# EasyEDA schematic I-Ching connection board v3_2020-09-12_02-23-30.json
TITLE: I-Ching connection board; REV: 1.3; Date: 2020-06-28; Sheet: 1/1; Drawn By: ferrie.bank; Company: Oude Snepelaar
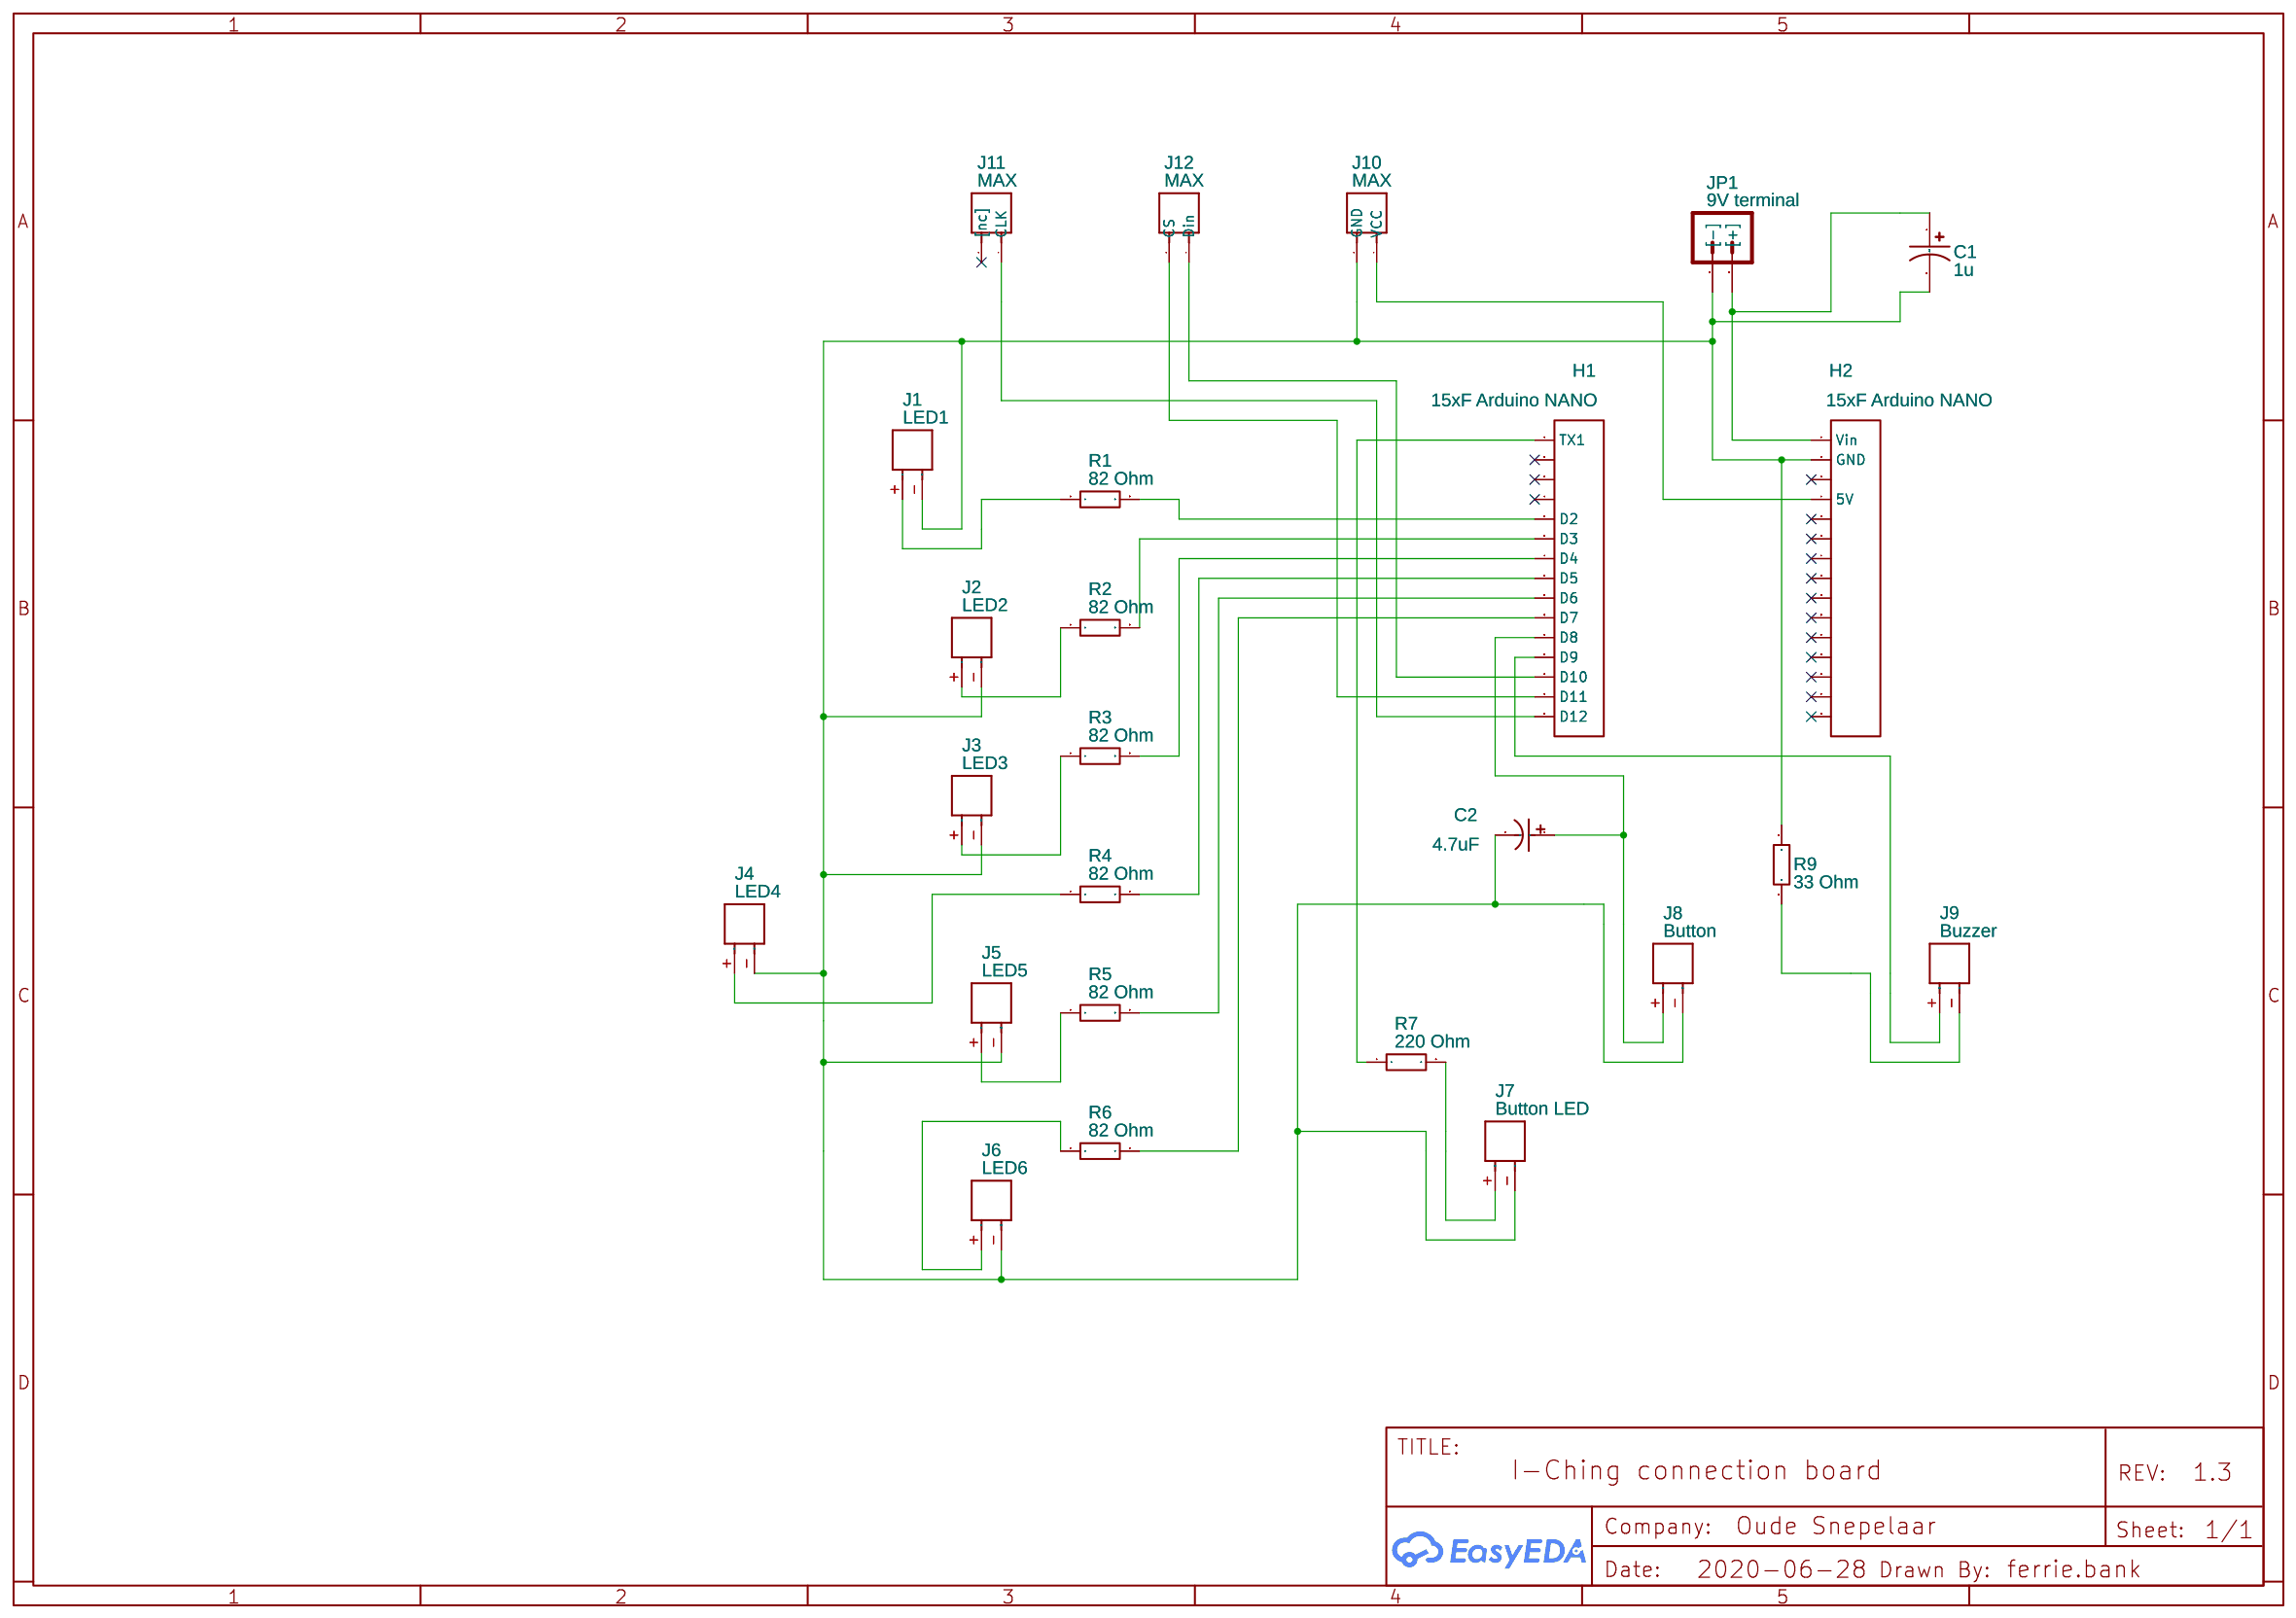
[diagram p0: schematic sheet]

## Parts
C1  1u  [CAP-D5.0×F2.0]
C2  4.7uF  [CAP-TH_BD5.0-P2.00-D0.8-FD]
H1  15xF Arduino NANO  [HDR-TH_15P-P2.54-V]
H2  15xF Arduino NANO  [HDR-TH_15P-P2.54-V]
J1  LED1  [H2-2.0-6X4.5MM]
J2  LED2  [H2-2.0-6X4.5MM]
J3  LED3  [H2-2.0-6X4.5MM]
J4  LED4  [H2-2.0-6X4.5MM]
J5  LED5  [H2-2.0-6X4.5MM]
J6  LED6  [H2-2.0-6X4.5MM]
J7  Button LED  [H2-2.0-6X4.5MM]
J8  Button  [H2-2.0-6X4.5MM]
J9  Buzzer  [H2-2.0-6X4.5MM]
J10  MAX  [H2-2.0-6X4.5MM]
J11  MAX  [H2-2.0-6X4.5MM]
J12  MAX  [H2-2.0-6X4.5MM]
JP1  9V terminal  [SCREWTERMINAL-5MM-2-DW]
R1  82 Ohm  [RES-TH_BD2.4-L6.3-P10.30-D0.6]
R2  82 Ohm  [RES-TH_BD2.4-L6.3-P10.30-D0.6]
R3  82 Ohm  [RES-TH_BD2.4-L6.3-P10.30-D0.6]
R4  82 Ohm  [RES-TH_BD2.4-L6.3-P10.30-D0.6]
R5  82 Ohm  [RES-TH_BD2.4-L6.3-P10.30-D0.6]
R6  82 Ohm  [RES-TH_BD2.4-L6.3-P10.30-D0.6]
R7  220 Ohm  [RES-TH_BD2.4-L6.3-P10.30-D0.6]
R9  33 Ohm  [RES-TH_BD2.4-L6.3-P10.30-D0.6]

## Library data of the parts
C1 = CE_TH_D5.0×F2.0_US: Contributor: LCEDA_Lib
C2 = 0.1UF 50V: Supplier: LCSC; Manufacturer: ValuePro; Supplier Part: C28061
H1 H2 = Header-Female-2.54_1x15: Supplier: LCSC; Manufacturer: Ckmtw; Manufacturer Part: 220S-1*15P H=8.5MM Ytype Gold-plated; Supplier Part: C124408
J1-J12 = ZB2001-02: DIP JST 2P-2.0
JP1 = Screw Terminal 2-Pin (5mm Pitch): Contributor: SparkFun; Package Display: No
R1-R7 R9 = MFR-25FTE52-300K: Supplier: LCSC; Supplier Part: C173001; Manufacturer: YAGEO; Contributor: LCSC

## Nets
Net-(C1-1): C1.1 H2.1(Vin) JP1.2([+])
Net-(C1-2): C1.2 C2.2 H2.2(GND) J1.-(P$2) J2.-(P$2) J3.-(P$2) J4.-(P$2) J5.-(P$2) J6.-(P$2) J7.-(P$2) J8.-(P$2) J10.+(GND) JP1.1([-]) R9.1
Net-(C2-1): C2.1 H1.11(D8) J8.+(P$1)
Net-(H1-1): H1.1(TX1) R7.1
Net-(H1-5): H1.5(D2) R1.2
Net-(H1-6): H1.6(D3) R2.2
Net-(H1-7): H1.7(D4) R3.2
Net-(H1-8): H1.8(D5) R4.2
Net-(H1-9): H1.9(D6) R5.2
Net-(H1-10): H1.10(D7) R6.2
Net-(H1-12): H1.12(D9) J9.+(P$1)
Net-(H1-13): H1.13(D10) J12.-(Din)
Net-(H1-14): H1.14(D11) J12.+(CS)
Net-(H1-15): H1.15(D12) J11.-(CLK)
Net-(H2-4): H2.4(5V) J10.-(VCC)
Net-(J1-+): J1.+(P$1) R1.1
Net-(J2-+): J2.+(P$1) R2.1
Net-(J3-+): J3.+(P$1) R3.1
Net-(J4-+): J4.+(P$1) R4.1
Net-(J5-+): J5.+(P$1) R5.1
Net-(J6-+): J6.+(P$1) R6.1
Net-(J7-+): J7.+(P$1) R7.2
Net-(J9--): J9.-(P$2) R9.2

Not connected (* = marked no-connect by the designer): H1 2* 3* 4*; H2 3* 5* 6* 7* 8* 9* 10* 11* 12* 13* 14* 15*; J11 +([nc])*
